# Altium schematic sheet FrontEnd.SchDoc: Projekt DAC AUPSC 2019
size A4; Date: 4.10.2019; Author: Michal Grzegorzek; SheetNumber: 3; SheetTotal: 4; Model: EM1; PageSetup: Record=PageOptions|CenterHorizontal=True|CenterVertical=True|PrintScale=0.52|XCorrection=1.00|YCorrection=1.00|PrintKind=1|BorderSize=5000000|LeftOffset=0|BottomOffset=0|Orientation=2|PaperLength=4200|PaperWidth=2970|Scale=100|PaperSource=7|PrintQuality=600|MediaType=1|DitherType=10|PaperKind=A3|PrintScaleMode=1
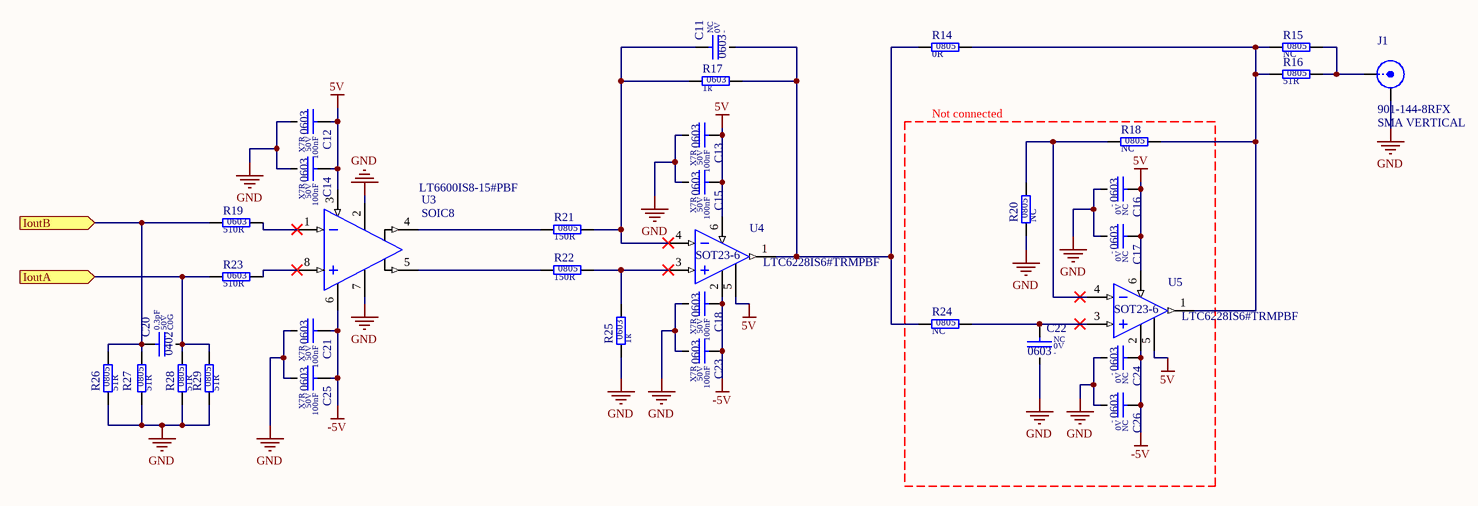
[diagram p0: FrontEnd.SchDoc]

## Parts
C11  value NC  Voltage: 0V  SCH_Footprint: 0603  [C_NC_0603_1608]  (hidden comment: -)
C12  value 100nF  Dielectric: X7R  Voltage: 50V  SCH_Footprint: 0603  [C_0603_1608]  (hidden comment: Ceramic X7R)
C13  value 100nF  Dielectric: X7R  Voltage: 50V  SCH_Footprint: 0603  [C_0603_1608]  (hidden comment: Ceramic X7R)
C14  value 100nF  Dielectric: X7R  Voltage: 50V  SCH_Footprint: 0603  [C_0603_1608]  (hidden comment: Ceramic X7R)
C15  value 100nF  Dielectric: X7R  Voltage: 50V  SCH_Footprint: 0603  [C_0603_1608]  (hidden comment: Ceramic X7R)
C16  value NC  Voltage: 0V  SCH_Footprint: 0603  [C_NC_0603_1608]  (hidden comment: -)
C17  value NC  Voltage: 0V  SCH_Footprint: 0603  [C_NC_0603_1608]  (hidden comment: -)
C18  value 100nF  Dielectric: X7R  Voltage: 50V  SCH_Footprint: 0603  [C_0603_1608]  (hidden comment: Ceramic X7R)
C20  value 0.3pF  Dielectric: C0G  Voltage: 50V  SCH_Footprint: 0402  [C_0402_1005]  (hidden comment: Ceramic C0G)
C21  value 100nF  Dielectric: X7R  Voltage: 50V  SCH_Footprint: 0603  [C_0603_1608]  (hidden comment: Ceramic X7R)
C22  value NC  Voltage: 0V  SCH_Footprint: 0603  [C_NC_0603_1608]  (hidden comment: -)
C23  value 100nF  Dielectric: X7R  Voltage: 50V  SCH_Footprint: 0603  [C_0603_1608]  (hidden comment: Ceramic X7R)
C24  value NC  Voltage: 0V  SCH_Footprint: 0603  [C_NC_0603_1608]  (hidden comment: -)
C25  value 100nF  Dielectric: X7R  Voltage: 50V  SCH_Footprint: 0603  [C_0603_1608]  (hidden comment: Ceramic X7R)
C26  value NC  Voltage: 0V  SCH_Footprint: 0603  [C_NC_0603_1608]  (hidden comment: -)
J1  value 901-144-8RFX  [J_SMA_VERTICAL]  (hidden comment: SMA VERTICAL)
R14  value 0R  SCH_Footprint: 0805  [R_0805_2012]  (hidden comment: Resistor)
R15  value NC  SCH_Footprint: 0805  [R_NC_0805_2012]  (hidden comment: Resistor)
R16  value 51R  SCH_Footprint: 0805  [R_0805_2012]  (hidden comment: Resistor)
R17  value 1k  SCH_Footprint: 0603  [R_0603_1608]  (hidden comment: Resistor)
R18  value NC  SCH_Footprint: 0805  [R_NC_0805_2012]  (hidden comment: Resistor)
R19  value 510R  SCH_Footprint: 0603  [R_0603_1608]  (hidden comment: Resistor)
R20  value NC  SCH_Footprint: 0805  [R_NC_0805_2012]  (hidden comment: Resistor)
R21  value 150R  SCH_Footprint: 0805  [R_0805_2012]  (hidden comment: Resistor)
R22  value 150R  SCH_Footprint: 0805  [R_0805_2012]  (hidden comment: Resistor)
R23  value 510R  SCH_Footprint: 0603  [R_0603_1608]  (hidden comment: Resistor)
R24  value NC  SCH_Footprint: 0805  [R_NC_0805_2012]  (hidden comment: Resistor)
R25  value 1k  SCH_Footprint: 0603  [R_0603_1608]  (hidden comment: Resistor)
R26  value 51R  SCH_Footprint: 0805  [R_0805_2012]  (hidden comment: Resistor)
R27  value 51R  SCH_Footprint: 0805  [R_0805_2012]  (hidden comment: Resistor)
R28  value 51R  SCH_Footprint: 0805  [R_0805_2012]  (hidden comment: Resistor)
R29  value 51R  SCH_Footprint: 0805  [R_0805_2012]  (hidden comment: Resistor)
U3  SCH_Footprint: SOIC8  [SOP8_SO8_SOIC8_4X5X18]  (hidden comment: LT6600IS8-15#PBF)
U4  value LTC6228IS6#TRMPBF  SCH_Footprint: SOT23-6  [SOT23-6_SC74A_SOT753]  (hidden comment: LTC6228IS6)
U5  value LTC6228IS6#TRMPBF  SCH_Footprint: SOT23-6  [SOT23-6_SC74A_SOT753]  (hidden comment: LTC6228IS6)

## Blocks framed on the sheet
Not connected: C16 C17 C22 C24 C26 R18 R20 R24 U5

## Ports
IoutA (in), IoutB (in)

## Nets
5V: C12.1 C13.1 C14.1 C15.1 C16.1 C17.1 U3.3(VDD) U4.5(~{SHDN}) U4.6(VDD) U5.5(~{SHDN}) U5.6(VDD)
-5V: C18.1 C21.1 C23.1 C24.1 C25.1 C26.1 U3.6(GND) U4.2(GND) U5.2(GND)
GND: C12.2 C13.2 C14.2 C15.2 C16.2 C17.2 C18.2 C21.2 C22.2 C23.2 C24.2 C25.2 C26.2 J1.2(GND) R20.1 R25.1 R26.1 R27.1 R28.1 R29.1 U3.2(Vocm) U3.7(Vmid)
IoutA: C20.2 R23.1 R28.2 R29.2 ; port IoutA
IoutB: C20.1 R19.1 R26.2 R27.2 ; port IoutB
NetC11_1: C11.1 R17.1 R21.2 U4.4(IN-)
NetC11_2: C11.2 R14.1 R17.2 R24.1 U4.1(OUT)
NetC22_1: C22.1 R24.2 U5.3(IN+)
NetJ1_1: J1.1(X) R15.2 R16.2
NetR14_2: R14.2 R15.1 R16.1 R18.2 U5.1(OUT)
NetR18_1: R18.1 R20.2 U5.4(IN-)
NetR19_2: R19.2 U3.1(IN-)
NetR21_1: R21.1 U3.4(OUT+)
NetR22_1: R22.1 U3.5(OUT-)
NetR22_2: R22.2 R25.2 U4.3(IN+)
NetR23_2: R23.2 U3.8(IN+)

## Notes on the sheet
- Title:
- Sheet:
- of
- Author:
- Model:
- Document Number:
- Checked by:
- Iss-Rev:
- Approved by:
- Date:
- File name:

## Library data of the parts
C11 C16 C17 C22 C24 C26 = C_GENERIC_0603: Capacitor; Tolerance (%): 0; Dielectric: -; Part Number: C_GENERIC_0603; HelpURL: http://-; Manufacturer: -; Manufacturer Part Number: -; Supplier 1: TME; Supplier 2: RS Components; Supplier 3: Farnell; Supplier 4: Mouser; Supplier 5: Digi-Key
C12-C15 C18 C21 C23 C25 = C_100nF_50V_X7R_0603_5: Capacitor; Manufacturer: Samsung; Manufacturer Part Number: CL10B104JB8NNNC; Tolerance (%): 5; Part Number: C_100nF_50V_X7R_0603_5; HelpURL: http://www.tme.eu/pl/Document/4a42202b32dab16128fe107dd69598cc/samsung-chip-cap.pdf; Supplier 1: TME; Supplier Part Number 1: CL10B104JB8NNNC; Supplier 2: RS Components; Supplier 3: Farnell; Supplier 4: Mouser; Supplier 5: Digi-Key
C20 = C_0.3pF_50V_C0G_0402_33: Capacitor; Manufacturer: Kemet; Manufacturer Part Number: CBR04C308B5GAC; Tolerance (%): 33; Part Number: C_0.3pF_50V_C0G_0402_33; HelpURL: http://www.farnell.com/datasheets/2202355.pdf; Supplier 1: TME; Supplier 2: RS Components; Supplier Part Number 2: 7697024; Supplier 3: Farnell; Supplier Part Number 3: 1973007; Supplier 4: Mouser; Supplier Part Number 4: 80-CBR04C308B5G; Supplier 5: Digi-Key; Supplier Part Number 5: 399-6155-1-ND
J1 = J_SMA_VERTICAL: SMA connector; Manufacturer: Amphenol RF; Part Number: J_SMA_VERTICAL; SCH_Footprint: SMA VERTICAL; Component Type: Standard; HelpURL: http://www.mouser.com/ds/2/18/C901-144-8RFX-710432.pdf; Manufacturer Part Number: 901-144-8RFX; Supplier 1: TME; Supplier 2: RS Components; Supplier 3: Farnell; Supplier Part Number 3: 1339820; Supplier 4: Mouser; Supplier Part Number 4: 523-901-144-8RFX; Supplier 5: Digi-Key; Supplier Part Number 5: ARFX1231-ND
R14 = R_0R_0805_5: Manufacturer: Stackpole Electronics Inc.; Manufacturer Part Number: RMCF0805ZT0R00; Voltage: 150V; Power: 125mW; Tolerance: 5%; Part Number: R_0R_0805_5; HelpURL: https://www.seielect.com/Catalog/SEI-RMCF_RMCP.pdf; Supplier 1: TME; Supplier 2: RS Components; Supplier 3: Farnell; Supplier 4: Mouser; Supplier 5: Digi-Key; Supplier Part Number 5: RMCF0805ZT0R00CT-ND
R15 R18 R20 R24 = R_GENERIC_0805: Part Number: R_GENERIC_0805; Supplier 1: TME; Supplier 2: RS Components; Supplier 3: Farnell; Supplier 4: Mouser; Supplier 5: Digi-Key
R16 R26-R29 = R_51R_0805_1: Manufacturer: Royalohm; Manufacturer Part Number: 0805S8F510JT5E; Voltage: 150V; Power: 125mW; Tolerance: 1%; Part Number: R_51R_0805_1; HelpURL: https://www.tme.eu/pl/Document/b315665a56acbc42df513c99b390ad98/ROYALOHM-THICKFILM.pdf; Supplier 1: TME; Supplier Part Number 1: SMD0805-51R-1%; Supplier 2: RS Components; Supplier 3: Farnell; Supplier 4: Mouser; Supplier 5: Digi-Key
R17 R25 = R_1k_0603_1: Manufacturer: Vishay; Manufacturer Part Number: CRCW06031K00FKEA; Voltage: 75V; Power: 100mW; Tolerance: 1%; Part Number: R_1k_0603_1; HelpURL: http://www.farnell.com/datasheets/2310790.pdf?_ga=2.256888843.1690599162.1548417389-1379097396.1542296996&_gac=1.262631934.1547230258.Cj0KCQiAmuHhBRD0ARIsAFWyPwhX8HcvXnM3tA0ZBodZLzDIjH2ZxLpjT5LWo9bad_HPRbU8LfPq44UaAhEwEALw_wcB; Supplier 1: TME; Supplier 2: RS Components; Supplier Part Number 2: 678-9875P; Supplier 3: Farnell; Supplier Part Number 3: 1469740; Supplier 4: Mouser; Supplier Part Number 4: 71-CRCW0603-1.0K-E3; Supplier 5: Digi-Key; Supplier Part Number 5: 541-1.00KHCT-ND
R19 R23 = R_510R_0603_1: Manufacturer: Vishay; Manufacturer Part Number: CRCW0603510RFKTABC; Voltage: 75V; Power: 100mW; Tolerance: 1%; Part Number: R_510R_0603_1; HelpURL: https://www.tme.eu/pl/Document/622e28308c06d160637f2b14751ba16b/Data%20Sheet%20CRCW_BCe3.pdf; Supplier 1: TME; Supplier Part Number 1: CRCW0603510RFKTABC; Supplier 2: RS Components; Supplier 3: Farnell; Supplier 4: Mouser; Supplier Part Number 4: 71-CRCW0603-510; Supplier 5: Digi-Key
R21 R22 = R_150R_0805_1: Manufacturer: Royalohm; Manufacturer Part Number: 0805S8F1503T5E; Voltage: 150V; Power: 125mW; Tolerance: 1%; Part Number: R_150R_0805_1; HelpURL: https://www.tme.eu/pl/Document/b315665a56acbc42df513c99b390ad98/ROYALOHM-THICKFILM.pdf; Supplier 1: TME; Supplier Part Number 1: SMD0805-150K-1%; Supplier 2: RS Components; Supplier 3: Farnell; Supplier 4: Mouser; Supplier 5: Digi-Key
U3 = U_LT6600IS8-15#PBF: Manufacturer: Analog Devices; Part Number: U_LT6600IS8-15#PBF; Value: LT6600IS8-15#PBF; HelpURL: https://www.analog.com/media/en/technical-documentation/data-sheets/660015fb.pdf; Manufacturer Part Number: LT6600IS8-15#PBF; Supplier 1: TME; Supplier 2: RS Components; Supplier 3: Farnell; Supplier 4: Mouser; Supplier Part Number 4: 584-LT6600IS8-15#PBF; Supplier 5: Digi-Key; Supplier Part Number 5: LT6600IS8-15#PBF-ND
U4 U5 = U_LTC6228IS6#TRPBF: Manufacturer: Analog Devices; Part Number: U_LTC6228IS6#TRPBF; HelpURL: https://www.analog.com/media/en/technical-documentation/data-sheets/LTC6228-6229.pdf; Manufacturer Part Number: LTC6228IS6#TRMPBF; Supplier 1: TME; Supplier 2: RS Components; Supplier 3: Farnell; Supplier 4: Mouser; Supplier Part Number 4: 584-6228IS6#TRMPBF; Supplier 5: Digi-Key; Supplier Part Number 5: LTC6228IS6#TRMPBFCT-ND